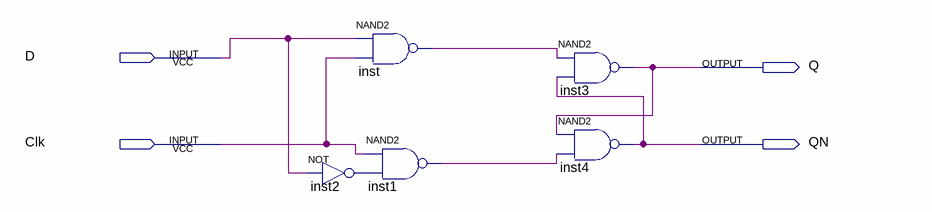
[diagram p0: schematic sheet]
// Quartus schematic lab9step2.bdf as structural Verilog: 5 symbols, 4 pins
module lab9step2 (
  input  D,
  input  Clk,
  output Q,
  output QN
);

  wire inst1_out, inst2_out, inst_out;

  not inst2 (inst2_out, D);
  nand inst (inst_out, D, Clk);
  nand inst1 (inst1_out, Clk, inst2_out);
  nand inst3 (Q, inst_out, QN);
  nand inst4 (QN, Q, inst1_out);
endmodule
